# EAGLE design PRoyecto (EAGLE 9.6.2)
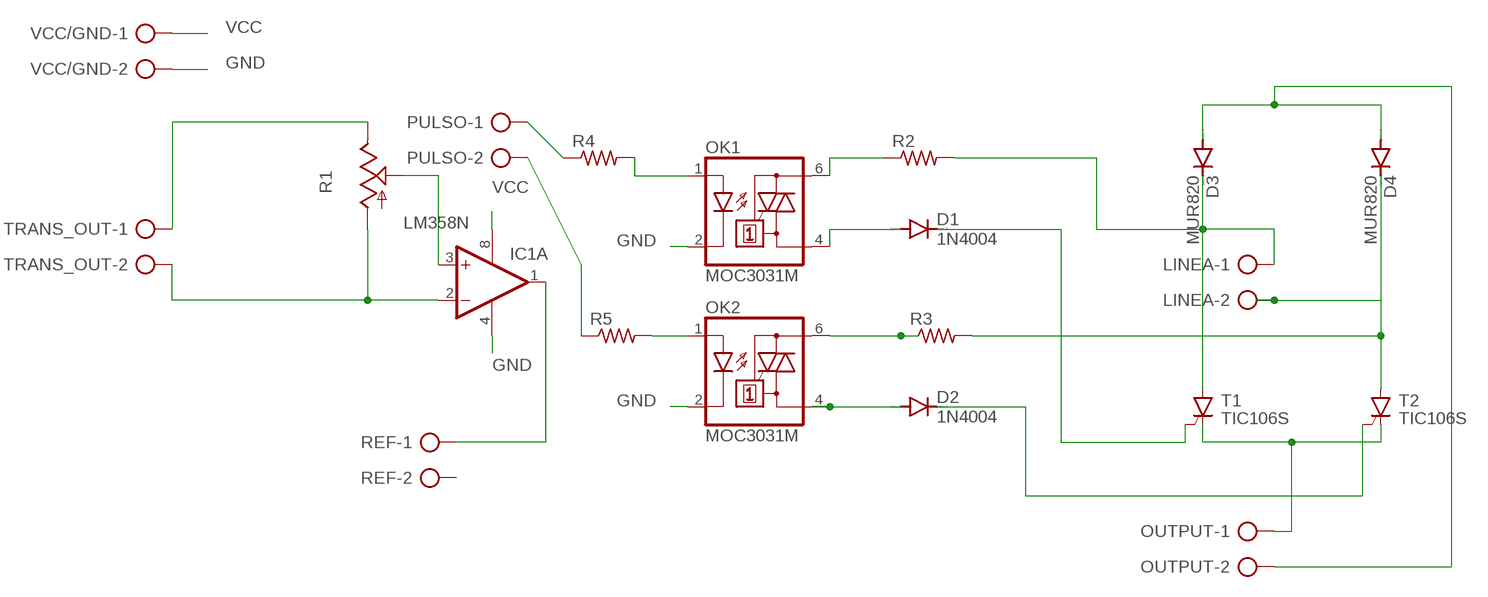
[diagram p0: schematic, sheet 1]

## Parts
D1  1N4004  [DO41-10]
D2  1N4004  [DO41-10]
D3  MUR820  [C221B1A]
D4  MUR820  [C221B1A]
IC1  LM358N  [DIL08]
LINEA  AK500/2-H  [AK500/2-H]
OK1  MOC3031M  [DIL06]
OK2  MOC3031M  [DIL06]
OUTPUT  AK500/2-H  [AK500/2-H]
PULSO  AK500/2-H  [AK500/2-H]
R1  TRIM_US-CIP20C-4MM  [CIP20C-4MM]
R2  R-US_0207/12  [0207/12]
R3  R-US_0207/12  [0207/12]
R4  R-US_0207/12  [0207/12]
R5  R-US_0207/12  [0207/12]
REF  AK500/2-H  [AK500/2-H]
T1  TIC106S  [TIC106S]
T2  TIC106S  [TIC106S]
TRANS_OUT  AK500/2-H  [AK500/2-H]
VCC/GND  AK500/2-H  [AK500/2-H]

## Nets
GND: IC1.4(P:V-) OK1.2(C) OK2.2(C) VCC/GND.2
N$1: OK1.1(A) R4.2
N$2: D4.C LINEA.2 R3.2 T2.A
N$3: OUTPUT.1 T1.C T2.C
N$4: D3.C LINEA.1 R2.2 T1.A
N$5: OK1.6(A2) R2.1
N$6: D1.A OK1.4(A1)
N$7: OK2.6(A2) R3.1
N$8: D2.A OK2.4(A1)
N$9: PULSO.1 R4.1
N$10: D1.C T1.G
N$11: D2.C T2.G
N$12: D3.A D4.A OUTPUT.2
N$13: PULSO.2 R5.1
N$14: OK2.1(A) R5.2
N$15: IC1.1(A:OUT) REF.1
N$16: IC1.3(A:+IN) R1.S
N$17: IC1.2(A:-IN) R1.A TRANS_OUT.2
N$18: R1.E TRANS_OUT.1
VCC: IC1.8(P:V+) VCC/GND.1
Unconnected: IC1.5(B:+IN) IC1.6(B:-IN) IC1.7(B:OUT) REF.2

## Library data of the parts
D1 D2 = diode:1N4004: DIODE general purpose rectifier, 1 A
D3 D4 = diode:MUR820: DIODE
IC1 = linear:LM358: OP AMP also LM158; LM258; LM2904 Source: http://cache.national.com/ds/LM/LM158.pdf
LINEA OUTPUT PULSO REF TRANS_OUT VCC/GND = con-ptr500:AK500/2-H: CONNECTOR Aug. 2004 / PTR Meßtechnik: Die Bezeichnung der Serie AK505 wurde geändert. Es handelt sich hierbei um AK500 in horizontaler Ausführung.; OC_FARNELL: unknown; OC_NEWARK: unknown
OK1 OK2 = optocoupler:MOC30*: 6-Pin DIP Zero-Cross Optoisolators Triac Driver Output (250/400 Volt Peak) Source: Data sheet <http://www.fairchildsemi.com/ds/MO/MOC3031M.pdf> The old path of data sheet not more available 2013-05-06.; MF: FAIRCHILD SEMICONDUCTOR; MPN: MOC3031M; OC_FARNELL: 9875964; OC_NEWARK: 78K6089
R1 = pot:TRIM_US-: POTENTIOMETER
R2-R5 = rcl:R-US_: RESISTOR, American symbol; SPICEPREFIX: R
T1 T2 = triac:TIC106S: THYRISTOR

## Board
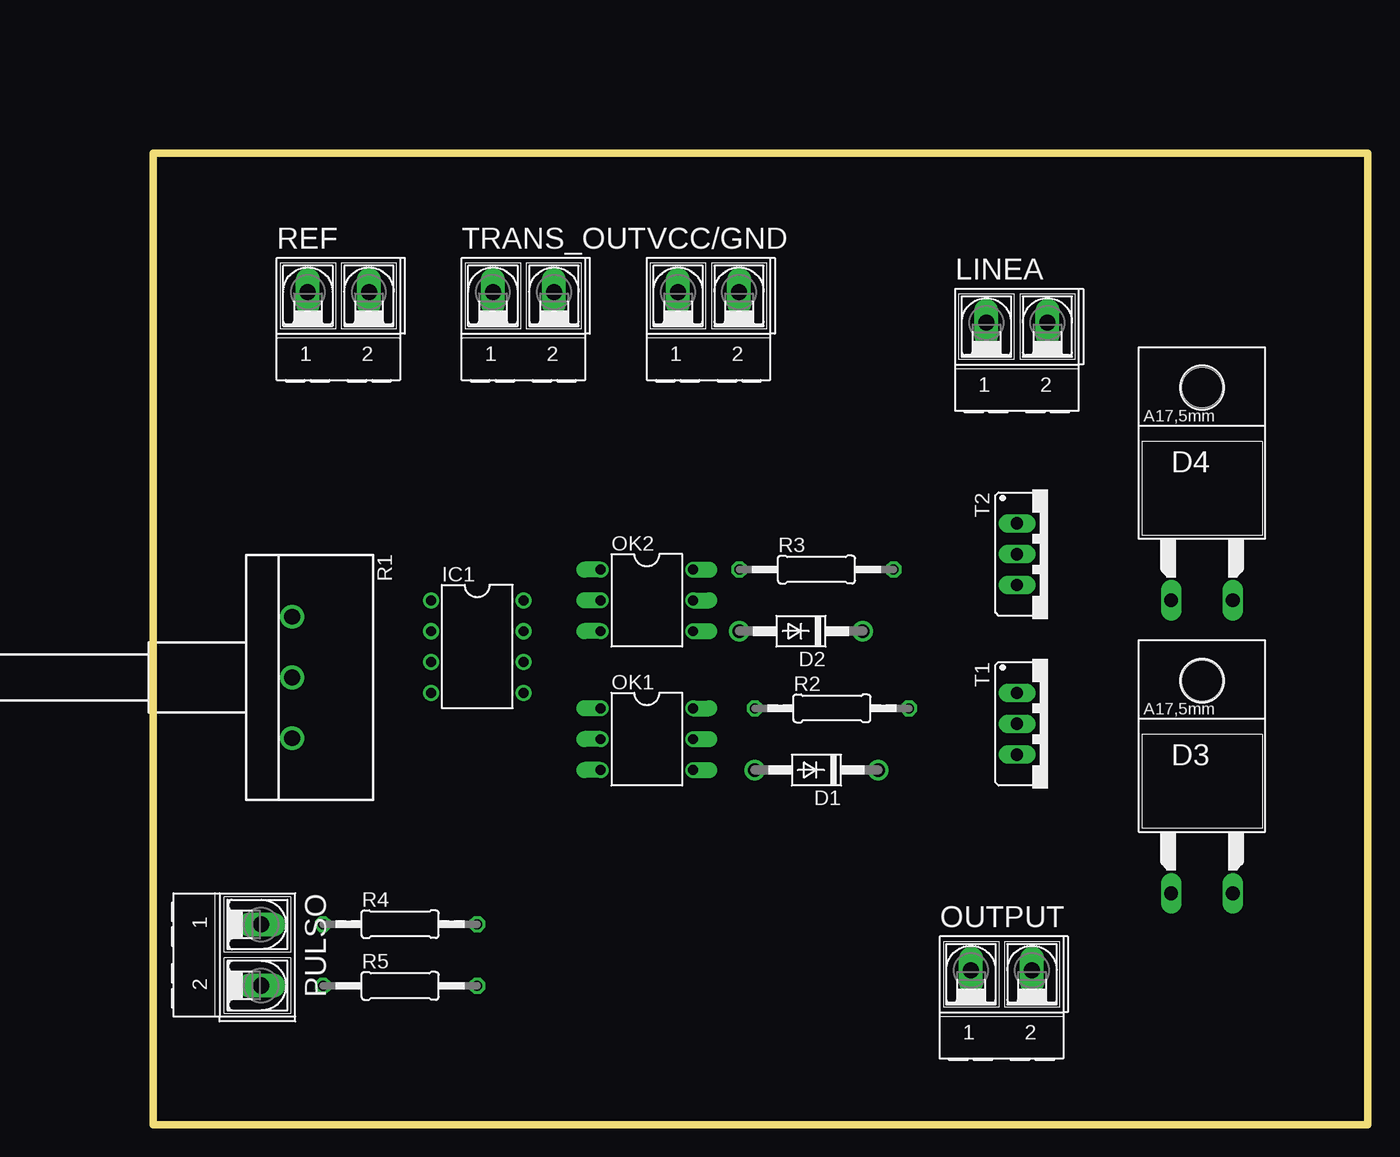
[diagram p1: board, top side]
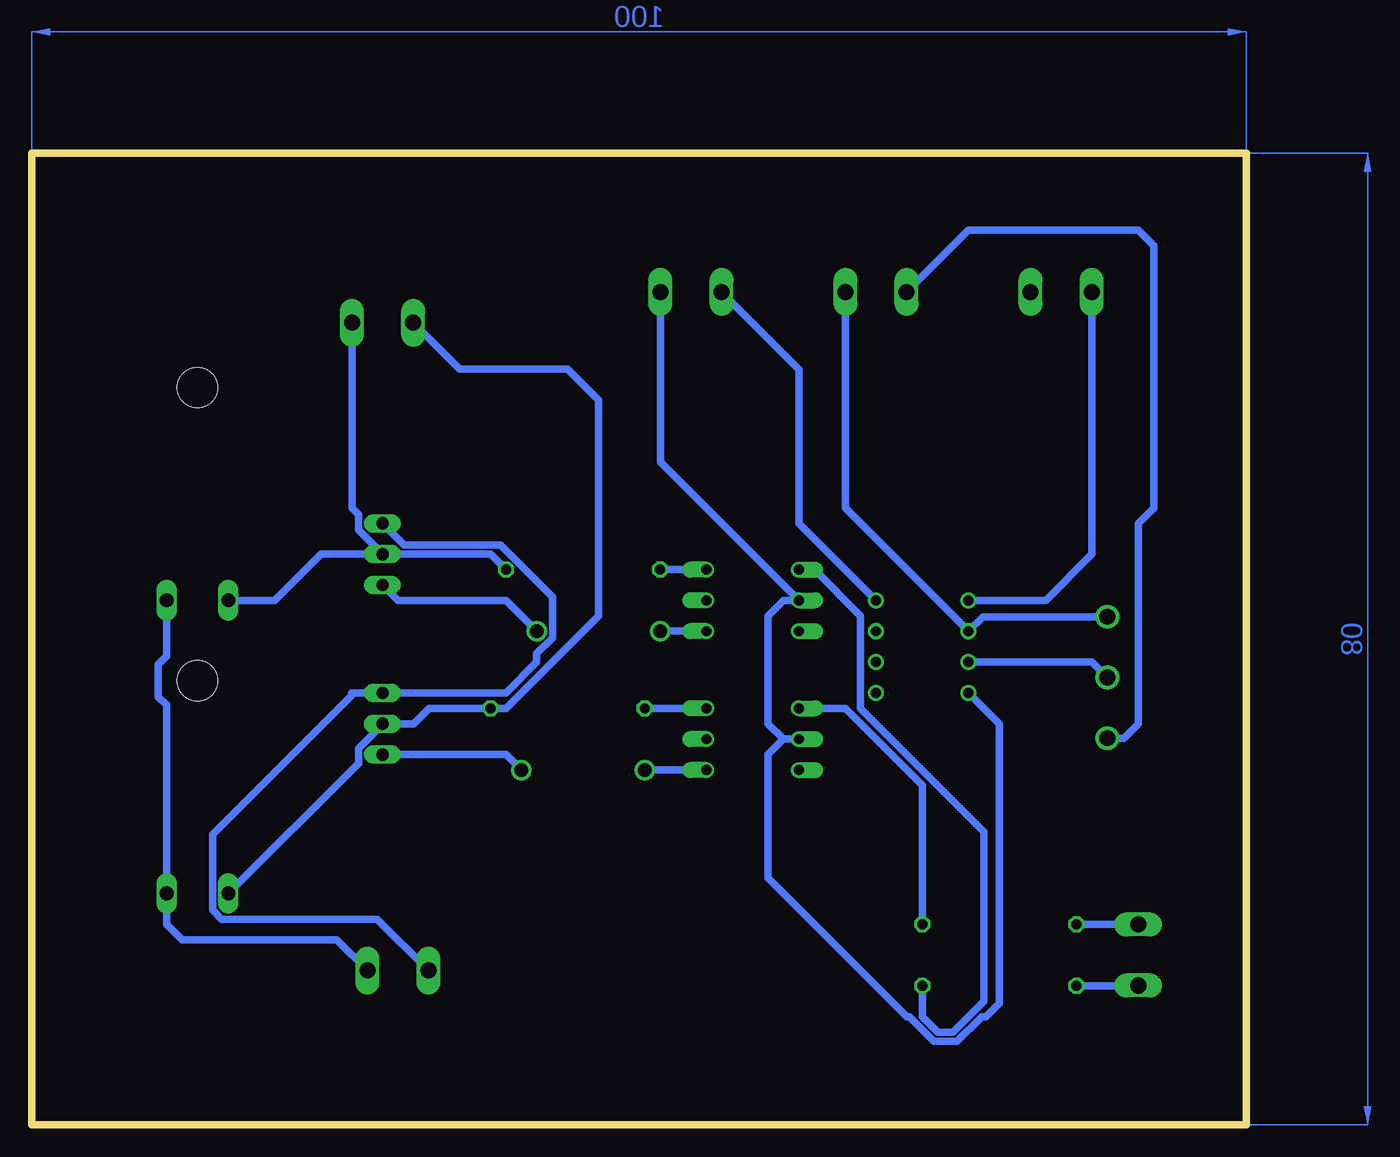
[diagram p2: board, bottom side, seen from below]

Size 100 x 80 mm. Coordinates in mm from the lower left corner, seen from the top.
Outline: 0,0 0,80 100,80 100,0 0,0
Copper layers (1*16): Top 0.035mm / dielectric 1.5mm / Bottom 0.035mm
Design rules "default": minimum track width 6mil, minimum drill 0.35mm, track to track 6mil, track to pad 6mil, pad to pad 6mil, via to via 6mil, smd to smd 6mil, copper to edge 40mil, drill to drill 6mil, minimum pad ring 10mil, minimum via ring 8mil, stop-mask expansion 4mil, vias tented up to drill 0mil, thermal gap 10mil

### Footprints (pad centres in the part's own frame; a part is rotated, then mirrored left to right if it is on the bottom)
DO41-10 = drill 1.118: A 5.08,0; C -5.08,0
C221B1A = drill 1.118 long: A 2.54,-6.35; C -2.54,-6.35 | hole 3.302: 0,11.176
DIL08 = drill 0.813 pad 1.27: 1 -3.81,-3.81; 2 -1.27,-3.81; 3 1.27,-3.81; 4 3.81,-3.81; 5 3.81,3.81; 6 1.27,3.81; 7 -1.27,3.81; 8 -3.81,3.81
AK500/2-H = drill 1.321 long: 1 -2.515,0; 2 2.515,0
DIL06 = drill 0.813 offset: 1 -2.54,-3.81; 2 0,-3.81; 3 2.54,-3.81; 4 2.54,3.81; 5 0,3.81; 6 -2.54,3.81
CIP20C-4MM = drill 1.3 pad 1.93: A -5,0; E 5,0; S 0,0
0207/12 = drill 0.813 octagon: 1 -6.35,0; 2 6.35,0
TIC106S = drill 1.016 long: A 0,-2.54; C -2.54,-2.54; G 2.54,-2.54

### Placement (x,y rotation side)
D1  54.61,29.21 180 top
D2  53.34,40.64 180 top
D3  86.36,25.4 0 top
D4  86.36,49.53 0 top
IC1  26.67,39.37 270 top
LINEA  71.12,66.04 0 top
OK1  40.64,31.75 270 top
OK2  40.64,43.18 270 top
OUTPUT  69.85,12.7 0 top
PULSO  8.89,13.97 270 top
R1  11.43,36.83 270 top
R2  55.88,34.29 0 top
R3  54.61,45.72 0 top
R4  20.32,16.51 0 top
R5  20.32,11.43 0 top
REF  15.24,68.58 0 top
T1  73.66,33.02 270 top
T2  73.66,46.99 270 top
TRANS_OUT  30.48,68.58 0 top
VCC/GND  45.72,68.58 0 top

### Tracks (layer width: path | path; a pad name or v marks a point on that pad's centre or on a via)
GND
  Bottom 0.61: OK1.2 38.1,31.75 | 38.1,31.75 39.37,33.02 39.37,41.91 38.1,43.18 OK2.2 48.23,54.59 VCC/GND.2 | IC1.4 20.32,33.02 20.32,10 21.43,8.89 21.78,8.89 23.81,6.86 25.72,6.86 27.75,8.89 27.94,8.89 39.37,20.32 39.37,30.48 38.1,31.75
N$1
  Bottom 0.61: R4.2 26.67,27.94 33.02,34.29 OK1.1
N$2
  Bottom 0.61: D4.C 80.01,43.18 76.2,46.99 T2.A | R3.2 62.23,46.99 T2.A | LINEA.2 73.64,50.77 73.1,50.24 73.1,48.97 T2.A
N$3
  Bottom 0.61: T2.C 69.34,47.75 61.41,47.75 57.12,43.47 57.12,40.1 58.42,38.81 58.42,38.1 60.96,35.56 T1.C 73.66,35.56 73.66,35.37 85.11,23.91 85.11,17.68 84.36,16.92 71.55,16.92 OUTPUT.1
N$4
  Bottom 0.61: LINEA.1 64.8,62.23 55.88,62.23 53.34,59.69 53.34,41.91 60.96,34.29 R2.2 67.31,34.29 68.58,33.02 T1.A 71.12,32.97 73.1,30.98 73.1,29.77 D3.C
N$5
  Bottom 0.61: OK1.6 R2.1
N$6
  Bottom 0.61: OK1.4 D1.A
N$7
  Bottom 0.61: OK2.6 R3.1
N$8
  Bottom 0.61: OK2.4 D2.A
N$9
  Bottom 0.61: PULSO.1 8.91,16.51 R4.1
N$10
  Bottom 0.61: D1.C 60.96,30.48 T1.G
N$11
  Bottom 0.61: D2.C 60.96,43.18 69.85,43.18 T2.G
N$12
  Bottom 0.61: D4.A 88.9,38.6 89.59,37.91 89.59,35.24 88.9,34.55 D3.A 88.9,16.51 87.63,15.24 74.91,15.24 OUTPUT.2
N$13
  Bottom 0.61: PULSO.2 8.91,11.43 R5.1
N$14
  Bottom 0.61: OK2.1 35.56,45.72 31.75,41.91 31.75,34.29 21.59,24.13 21.59,10.16 24.13,7.62 25.4,7.62 26.67,8.89 R5.2
N$15
  Bottom 0.61: IC1.1 16.51,43.18 12.7,46.99 12.7,68.56 REF.1
N$16
  Bottom 0.61: R1.S 12.7,38.1 IC1.3
N$17
  Bottom 0.61: R1.A 21.67,41.83 IC1.2 32.99,50.77 TRANS_OUT.2
N$18
  Bottom 0.61: TRANS_OUT.1 22.89,73.66 8.89,73.66 7.62,72.39 7.62,50.8 8.89,49.53 8.89,33.02 10.08,31.83 R1.E
VCC
  Bottom 0.61: VCC/GND.1 36.83,62.2 36.83,49.53 IC1.8
(copper drawn outside any net)
  shapes: Bottom area x2